# Altium schematic sheet CPU.SchDoc: CPU/RAM/ROM
size A
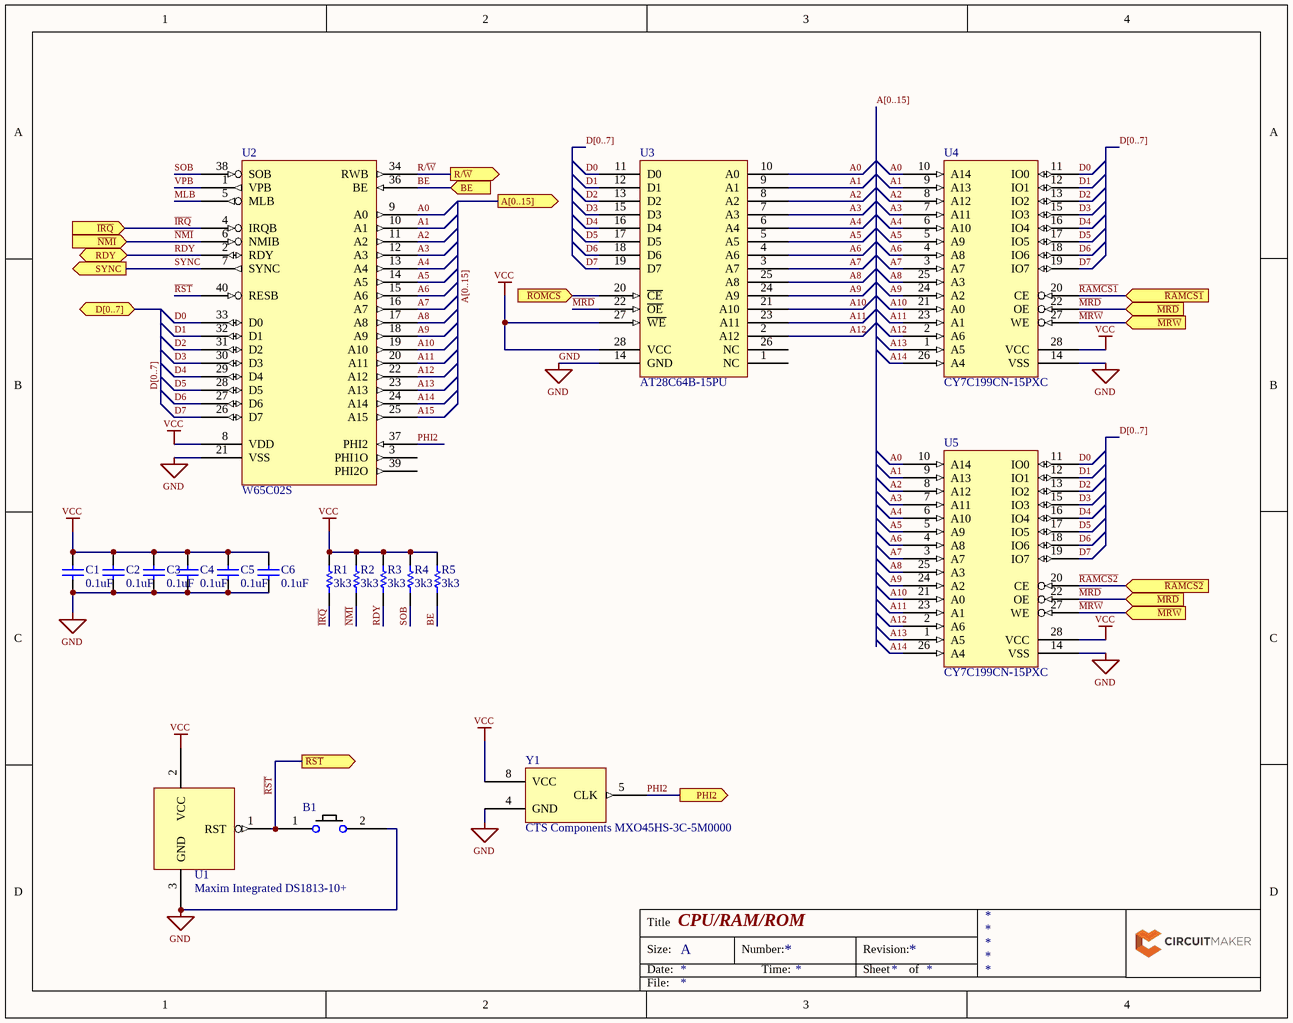
[diagram p0: CPU.SchDoc]

## Parts
B1  TE Connectivity / AMP 2-1825910-7  [PCB-zc3gki7bdkzygyfrqq6y-1]  (value not drawn)
C1  0.1uF  [CAPC1608X90X35NL15T15]
C2  0.1uF  [CAPC1608X90X35NL15T15]
C3  0.1uF  [CAPC1608X90X35NL15T15]
C4  0.1uF  [CAPC1608X90X35NL15T15]
C5  0.1uF  [CAPC1608X90X35NL15T15]
C6  0.1uF  [CAPC1608X90X35NL15T15]
R1  3k3  [RESC1608X55X30ML20T10]
R2  3k3  [RESC1608X55X30ML20T10]
R3  3k3  [RESC1608X55X30ML20T10]
R4  3k3  [RESC1608X55X30ML20T10]
R5  3k3  [RESC1608X55X30ML20T10]
U1  Maxim Integrated DS1813-10+  [PCB-n3dkw18s287l3ux4xt5g-1]
U2  W65C02S  [PCB-pok82zhzxzvu1tt0yxpn-1]
U3  AT28C64B-15PU  [PCB-0g11s820xjhkjlfxzqv3-1]
U4  CY7C199CN-15PXC  [PCB-dmo4zvmf3gxrfi0q9iqk-1]
U5  CY7C199CN-15PXC  [PCB-dmo4zvmf3gxrfi0q9iqk-1]
Y1  CTS Components MXO45HS-3C-5M0000  [PCBComponent_1 - duplicate]

## Ports
A[0..15] (out), BE (in), D[0..7] (bidir), PHI2 (out), R/~{W} (out), RDY (bidir), SYNC (out), ~{IRQ} (in), ~{MRD} (in), ~{MRW} (in), ~{NMI} (in), ~{RAMCS1} (in), ~{RAMCS2} (in), ~{ROMCS} (in), ~{RST} (out)

## Nets
GND: B1.2 C1.2 C2.2 C3.2 C4.2 C5.2 C6.2 U1.3(GND) U2.21(VSS) U3.14(GND) U4.14(VSS) U5.14(VSS) Y1.4(GND)
VCC: C1.1 C2.1 C3.1 C4.1 C5.1 C6.1 R1.1 R2.1 R3.1 R4.1 R5.1 U1.2(VCC) U2.8(VDD) U3.27(~{WE}) U3.28(VCC) U4.28(VCC) U5.28(VCC) Y1.8(VCC)
A0: U2.9(A0) U3.10(A0) U4.10(A14) U5.10(A14)
A1: U2.10(A1) U3.9(A1) U4.9(A13) U5.9(A13)
A2: U2.11(A2) U3.8(A2) U4.8(A12) U5.8(A12)
A3: U2.12(A3) U3.7(A3) U4.7(A11) U5.7(A11)
A4: U2.13(A4) U3.6(A4) U4.6(A10) U5.6(A10)
A5: U2.14(A5) U3.5(A5) U4.5(A9) U5.5(A9)
A6: U2.15(A6) U3.4(A6) U4.4(A8) U5.4(A8)
A7: U2.16(A7) U3.3(A7) U4.3(A7) U5.3(A7)
A8: U2.17(A8) U3.25(A8) U4.25(A3) U5.25(A3)
A9: U2.18(A9) U3.24(A9) U4.24(A2) U5.24(A2)
A10: U2.19(A10) U3.21(A10) U4.21(A0) U5.21(A0)
A11: U2.20(A11) U3.23(A11) U4.23(A1) U5.23(A1)
A12: U2.22(A12) U3.2(A12) U4.2(A6) U5.2(A6)
A13: U2.23(A13) U4.1(A5) U5.1(A5)
A14: U2.24(A14) U4.26(A4) U5.26(A4)
A15: U2.25(A15)
BE: R5.2 U2.36(BE) ; port BE
D0: U2.33(D0) U3.11(D0) U4.11(IO0) U5.11(IO0)
D1: U2.32(D1) U3.12(D1) U4.12(IO1) U5.12(IO1)
D2: U2.31(D2) U3.13(D2) U4.13(IO2) U5.13(IO2)
D3: U2.30(D3) U3.15(D3) U4.15(IO3) U5.15(IO3)
D4: U2.29(D4) U3.16(D4) U4.16(IO4) U5.16(IO4)
D5: U2.28(D5) U3.17(D5) U4.17(IO5) U5.17(IO5)
D6: U2.27(D6) U3.18(D6) U4.18(IO6) U5.18(IO6)
D7: U2.26(D7) U3.19(D7) U4.19(IO7) U5.19(IO7)
~{IRQ}: R1.2 U2.4(IRQB) ; port ~{IRQ}
~{MRD}: U3.22(~{OE}) U4.22(OE) U5.22(OE) ; port ~{MRD}
~{MRW}: U4.27(WE) U5.27(WE) ; port ~{MRW}
MLB: U2.5(MLB)
~{NMI}: R2.2 U2.6(NMIB) ; port ~{NMI}
PHI2: U2.37(PHI2) Y1.5(CLK) ; port PHI2
R/~{W}: U2.34(RWB) ; port R/~{W}
~{RAMCS1}: U4.20(CE) ; port ~{RAMCS1}
~{RAMCS2}: U5.20(CE) ; port ~{RAMCS2}
~{ROMCS}: U3.20(~{CE}) ; port ~{ROMCS}
~{RST}: B1.1 U1.1(RST) U2.40(RESB) ; port ~{RST}
RDY: R3.2 U2.2(RDY) ; port RDY
SOB: R4.2 U2.38(SOB)
SYNC: U2.7(SYNC) ; port SYNC
VPB: U2.1(VPB)

Not connected (* = marked no-connect by the designer): U2 3(PHI1O) 39(PHI2O); U3 1(NC) 26(NC); Y1 1(NC)

## Buses and harness runs
bus A[0..15]
bus A[0..15] = port A[0..15]
bus D[0..7]
bus D[0..7] = port D[0..7]

## Notes on the sheet
- Title
- Size:
- Date:
- A
- Number:
- Time:
- Revision:
- Sheet
- of
- File:

## Library data of the parts
B1 = CMP-3008f9696383efcf-2: Switch Tactile OFF (ON) SPST Extended Round Button PC Pins 0.05A 24VDC 100000Cycles 1.57N Thru-Hole Loose; ELV Compliant: Compliant; Lead-Free Status: Lead Free; Mounting Style: Through Hole; Contact Material: Copper Alloy; Octopart URL: http://octopart.com/2-1825910-7-te+connectivity+%2F+amp-7042797; Manufacturer Part Number: 2-1825910-7; Packaging: Bag; RoHS: Compliant; Lifecycle Status: Active; OctopartID: 3008f9696383efcf
C1-C6 = CMP-15328962-11: 0603 0.1uF Capacitor; Insulation Resistance: 1e+11 Ω; Voltage Rating (DC): 16.0 V; Lead-Free Status: Lead Free; Dielectric Material: Ceramic Multilayer; Dielectric Characteristic: X7R; Capacitance Tolerance: ±10%; Capacitance: 1e-07 F; OctopartID: 0cd5c6920958d312; Number of Pins: 2; Size-Length: 0.0016002 m; Octopart Url: https://octopart.com/0603yc104kat2a-avx+interconnect+%2F+elco-55386347; Size-Height: 0.00086 m; Case/Package: 0603; REACH SVHC Compliance: No SVHC; RoHS: Compliant; Mounting Style: Surface Mount; Size-Width: 0.0008128 m
R1-R5 = CMP-3658446-2: Thick Film Resistors - SMD 1/10watt 3.3Kohms 1%; Lead-Free Status: Lead Free; Power Rating: 0.1 W; Resistance: 3300.0 Ω; Case/Package: 0603; Mounting Style: Surface Mount; Octopart Url: https://octopart.com/rk73h1jttd3301f-koa+speer-5071100; OctopartID: 55949cd3100e8a53; Resistance Tolerance: ±1%; RoHS: Compliant
U1 = CMP-1accd3d08fc8c50b-1: Processor Supervisor 4.35V 0V to 5.5V 3-Pin TO-92; Lead-Free Status: Contains Lead; Threshold Voltage: 4.62 V; Supply Voltage (DC): V; Supply Current: 3e-05 A; RoHS: Compliant; Manufacturer Part Number: DS1813-10+; Mounting Style: Through Hole; Lifecycle Status: Not Listed by Manufacturer; Octopart URL: http://octopart.com/ds1813-10%2B-maxim+integrated-1486946; Packaging: Bulk; OctopartID: 1accd3d08fc8c50b; Output Voltage: V; Number of Pins: 3
U2 = CMP-6947a10c43c7b680-3: 6502 CPU; Manufacturer Part Number: W65C02S6TPG-14; OctopartID: 6947a10c43c7b680; Octopart URL: http://octopart.com/w65c02s6tpg-14-western+design+center-21041126
U3 = CMP-2d70e7372d9bf2b7-4: AT28C64B Series 64 KB (8 K x 8) 5.5 V High-Performance Parallel EEPROM - DIP-28
U4 U5 = CMP-7b4ab247c01fa48d-3: SRAM Chip Async Single 5V 256K-bit 32K x 8 15ns 28-Pin PDIP Tube; Memory Size: 32000 B; Access Time: 1.5e-08 s; Supply Voltage (DC): 5.0 V; Clock Speed: 15000000000.0 Hz; Lead-Free Status: Lead Free; OctopartID: 7b4ab247c01fa48d; Case/Package: DIP; REACH SVHC Compliance: No SVHC; Lifecycle Status: Active; Mounting Style: Through Hole; Manufacturer Part Number: CY7C199CN-15PXC; Octopart URL: http://octopart.com/cy7c199cn-15pxc-cypress+semiconductor-499251; Number of Pins: 28; RoHS: Compliant; Packaging: Tube, Bulk
Y1 = CMP-6fd7a61dc048b010-4: Oscillator XO 5MHz ??50ppm 50pF (Stability) HCMOS/TTL 55% 5V 4-Pin Metal DIP Thru-Hole Tray; RoHS: Compliant; Mounting Style: Through Hole; Case/Package: DIP; Octopart URL: http://octopart.com/mxo45hs-3c-5m0000-cts+components-12618489; Manufacturer Part Number: MXO45HS-3C-5M0000; OctopartID: 6fd7a61dc048b010; Packaging: Tray